# Altium schematic sheet kien1_SCH.SchDoc
size 381 x 241 mm; SheetNumber: 1; SheetTotal: 1
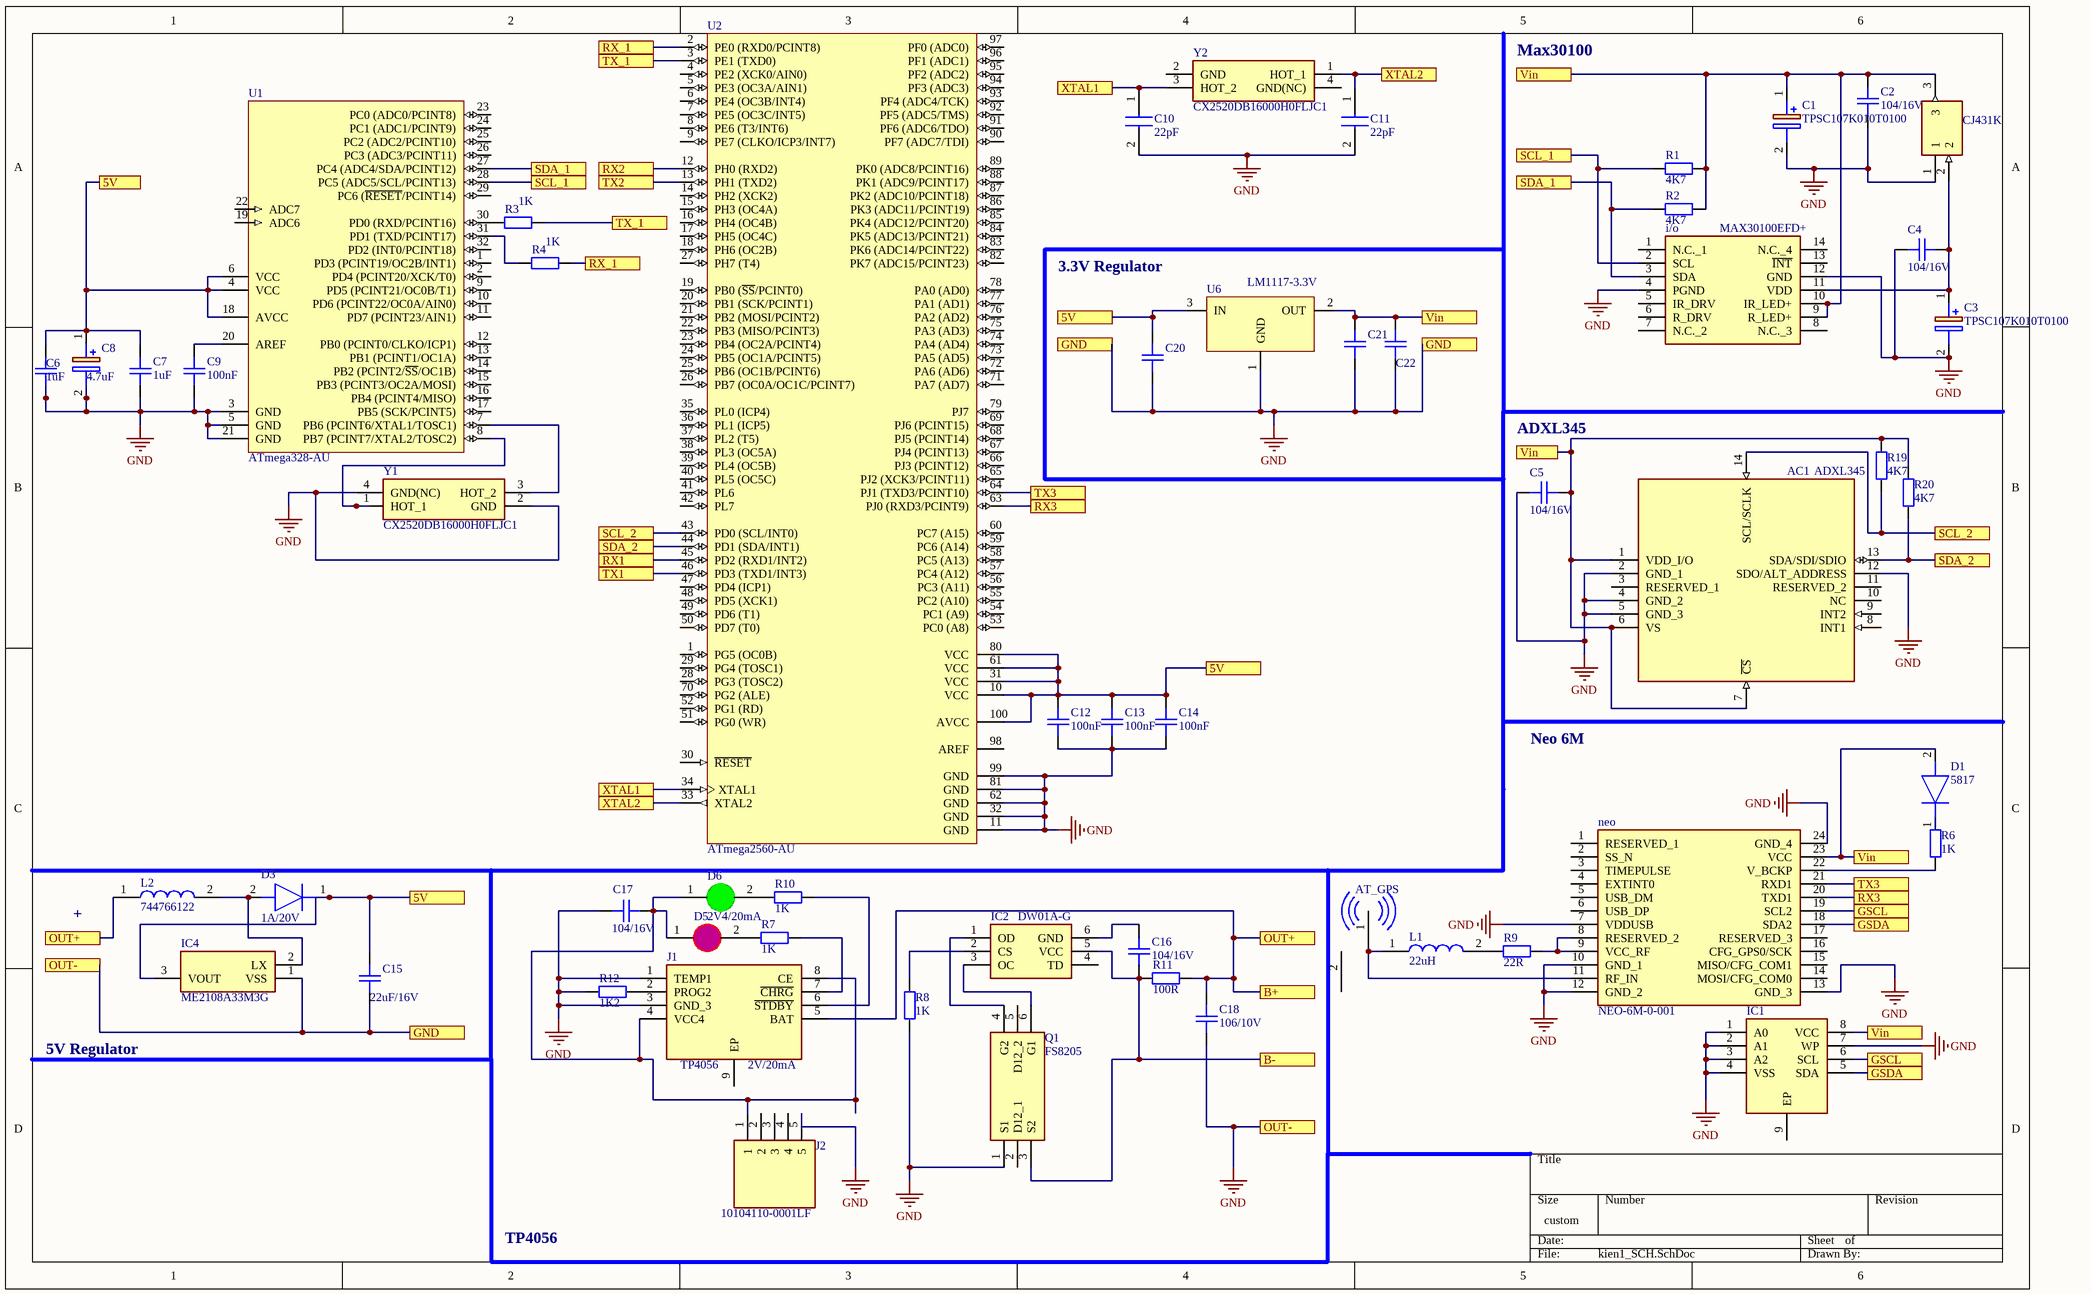
[diagram p0: kien1_SCH.SchDoc]

## Parts
?  CJ431K  [SOT92P240X115-3N]
AC1  ADXL345  [CC-14-1]
AT_GPS  IPEX_CON  [U.FL/UMCC]  (value not drawn)
C1  TPSC107K010T0100  [CAPPM6032X280N]
C2  104/16V  [CAPC-0402 (1005)]
C3  TPSC107K010T0100  [CAPPM6032X280N]
C4  104/16V  [CAPC-0402 (1005)]
C5  104/16V  [CAPC-0402 (1005)]
C6  1uF  [CAPC-0402 (1005)]
C7  1uF  [CAPC-0402 (1005)]
C8  4.7uF  [CAPPM3528X210N]
C9  100nF  [CAPC-0402 (1005)]
C10  22pF  [C0402]
C11  22pF  [C0402]
C12  100nF  [CAPC-0402 (1005)]
C13  100nF  [CAPC-0402 (1005)]
C14  100nF  [CAPC-0402 (1005)]
C15  22uF/16V  [CAPC-0603 (1608)]
C16  104/16V  [CAPC-0402 (1005)]
C17  104/16V  [CAPC-0402 (1005)]
C18  106/10V  [CAPC-0603 (1608)]
C20  (no value)  [CAPC-0603 (1608)]
C21  (no value)  [CAPC-0603 (1608)]
C22  (no value)  [CAPC-0402 (1005)]
D1  5817  [CD123DB120R]
D3  1A/20V  [NSR10F20NXT5G]
D5  2V/20mA  [LED_0805_RED]
D6  2V4/20mA  [LED_0805_GREEN]
i/o  MAX30100EFD+  [MAX30100EFD]
IC1  (no value)  [SON50P300X200X100-9N-D]
IC2  DW01A-G  [SOT95P280X135-6N]
IC4  ME2108A33M3G  [SOT95P250X130-3N]
J1  TP4056  [SOIC127P600X175-9N]
J2  10104110-0001LF  [101041100001LF]
L1  22uH  [INDPM4532X360N]
L2  744766122  [INDPM4532X360N]
neo  NEO-6M-0-001  [NEO6M0001]
Q1  FS8205  [FS8205]
R1  4K7  [RESC-0603 (1608)]
R2  4K7  [RESC-0603 (1608)]
R3  1K  [RESC-0603 (1608)]
R4  1K  [RESC-0603 (1608)]
R6  1K  [RESC-0603 (1608)]
R7  1K  [RESC-0603 (1608)]
R8  1K  [RESC-0603 (1608)]
R9  22R  [RESC-0603 (1608)]
R10  1K  [RESC-0603 (1608)]
R11  100R  [RESC-0603 (1608)]
R12  1K2  [RESC-0603 (1608)]
R19  4K7  [RESC-0603 (1608)]
R20  4K7  [RESC-0603 (1608)]
U1  ATmega328-AU  [TQFP32]
U2  ATmega2560-AU  [TQFP100L]
U6  LM1117-3.3V  [SOT223]
Y1  CX2520DB16000H0FLJC1  [CX2520DB16000H0FLJC1]
Y2  CX2520DB16000H0FLJC1  [CX2520DB16000H0FLJC1]

## Ports
5V, B+, B-, GND, GSCL, GSDA, OUT+, OUT-, RX1, RX2, RX3, RX_1, SCL_1, SCL_2, SDA_1, SDA_2, TX1, TX2, TX3, TX_1, Vin, XTAL1, XTAL2

## Nets
GND: ?.1 AC1.2(GND_1) AC1.4(GND_2) AC1.5(GND_3) AC1.12(SDO/ALT_ADDRESS) C1.2(-) C2.2 C3.2(-) C4.1 C5.1 C6.2 C7.2 C8.2(-) C9.2 C10.2 C11.2 C12.2 C13.2 C14.2 C15.2 C17.1 C18.2 C20.2 C21.2 C22.2 i/o.4(PGND) i/o.12(GND) IC1.1(A0) IC1.2(A1) IC1.3(A2) IC1.4(VSS) IC1.7(WP) IC4.1(VSS) J1.1(TEMP1) J1.3(GND_3) J2.5 neo.7(VDDUSB) neo.10(GND_1) neo.12(GND_2) neo.13(GND_3) neo.24(GND_4) Q1.1(S1) R8.2 R12.1 U1.3(GND) U1.5(GND) U1.21(GND) U2.11(GND) U2.32(GND) U2.62(GND) U2.81(GND) U2.99(GND) U6.1(GND) Y1.2(GND) Y1.4(GND(NC)) ; port GND, port OUT-
5V: C6.1 C7.1 C8.1(+) C12.1 C13.1 C14.1 C15.1 C20.1 D3.1(K) IC4.3(VOUT) U1.4(VCC) U1.6(VCC) U1.18(AVCC) U2.10(VCC) U2.31(VCC) U2.61(VCC) U2.80(VCC) U2.100(AVCC) U6.3(IN) ; port 5V
B+: C18.1 J1.5(BAT) L2.1 R11.2 ; port OUT+, port B+
B-: C16.2 IC2.5(VCC) Q1.3(S2) R11.1 ; port B-
GSCL: IC1.6(SCL) neo.19(SCL2) ; port GSCL
GSDA: IC1.5(SDA) neo.18(SDA2) ; port GSDA
RX1: U2.45(PD2_(RXD1/INT2)) ; port RX1
RX2: U2.12(PH0_(RXD2)) ; port RX2
RX3: neo.20(TXD1) U2.63(PJ0_(RXD3/PCINT9)) ; port RX3
RX_1: R4.2 U2.2(PE0_(RXD0/PCINT8)) ; port RX_1
SCL_1: i/o.2(SCL) R1.1 U1.28(PC5_(ADC5/SCL/PCINT13)) ; port SCL_1
SCL_2: AC1.14(SCL/SCLK) R19.2 U2.43(PD0_(SCL/INT0)) ; port SCL_2
SDA_1: i/o.3(SDA) R2.1 U1.27(PC4_(ADC4/SDA/PCINT12)) ; port SDA_1
SDA_2: AC1.13(SDA/SDI/SDIO) R20.2 U2.44(PD1_(SDA/INT1)) ; port SDA_2
TX1: U2.46(PD3_(TXD1/INT3)) ; port TX1
TX2: U2.13(PH1_(TXD2)) ; port TX2
TX3: neo.21(RXD1) U2.64(PJ1_(TXD3/PCINT10)) ; port TX3
TX_1: R3.2 U2.3(PE1_(TXD0)) ; port TX_1
Vin: ?.3 AC1.1(VDD_I/O) AC1.6(VS) AC1.7(~{CS}) C1.1(+) C2.1 C5.2 C21.1 C22.1 D1.2(A) i/o.9(R_LED+) i/o.10(IR_LED+) IC1.8(VCC) neo.23(VCC) R1.2 R2.2 R19.1 R20.1 U6.2(OUT) ; port Vin
XTAL1: C10.1 U2.34(XTAL1) Y2.3(HOT_2) ; port XTAL1
XTAL2: C11.1 U2.33(XTAL2) Y2.1(HOT_1) ; port XTAL2
Net?_2: ?.2 C3.1(+) C4.2 i/o.11(VDD)
NetAT_GPS_1: AT_GPS.1(AT) L1.1 neo.11(RF_IN)
NetC9_1: C9.1 U1.20(AREF)
NetC16_1: C16.1 IC2.6(GND)
NetC17_2: C17.2 D5.1(A) D6.1(A) J1.4(VCC4) J1.8(CE) J2.1
NetD1_1: D1.1(K) R6.1
NetD3_2: D3.2(A) IC4.2(LX) L2.2
NetD5_2: D5.2(K) R7.1
NetD6_2: D6.2(K) R10.1
NetIC2_1: IC2.1(OD) Q1.4(G2)
NetIC2_2: IC2.2(CS) R8.1
NetIC2_3: IC2.3(OC) Q1.6(G1)
NetJ1_2: J1.2(PROG2) R12.2
NetJ1_6: J1.6(~{STDBY}) R10.2
NetJ1_7: J1.7(~{CHRG}) R7.2
NetL1_2: L1.2 R9.1
Netneo_8: neo.8(RESERVED_2) neo.9(VCC_RF) R9.2
Netneo_22: neo.22(V_BCKP) R6.2
NetR3_1: R3.1 U1.30(PD0_(RXD/PCINT16))
NetR4_1: R4.1 U1.31(PD1_(TXD/PCINT17))
NetU1_7: U1.7(PB6_(PCINT6/XTAL1/TOSC1)) Y1.3(HOT_2)
NetU1_8: U1.8(PB7_(PCINT7/XTAL2/TOSC2)) Y1.1(HOT_1)

Not connected (* = marked no-connect by the designer): AC1 3(RESERVED_1) 8(INT1) 9(INT2) 10(NC) 11(RESERVED_2); AT_GPS 2(0); i/o 1(N.C._1) 5(IR_DRV) 6(R_DRV) 7(N.C._2) 8(N.C._3) 13(~{INT}) 14(N.C._4); IC1 9(EP); IC2 4(TD); J1 9(EP); J2 2 3 4; neo 1(RESERVED_1) 2(SS_N) 3(TIMEPULSE) 4(EXTINT0) 5(USB_DM) 6(USB_DP) 14(MOSI/CFG_COM0) 15(MISO/CFG_COM1) 16(CFG_GPS0/SCK) 17(RESERVED_3); Q1 2(D12_1) 5(D12_2); U1 1(PD3_(PCINT19/OC2B/INT1)) 2(PD4_(PCINT20/XCK/T0)) 9(PD5_(PCINT21/OC0B/T1)) 10(PD6_(PCINT22/OC0A/AIN0)) 11(PD7_(PCINT23/AIN1)) 12(PB0_(PCINT0/CLKO/ICP1)) 13(PB1_(PCINT1/OC1A)) 14(PB2_(PCINT2/~{SS}/OC1B)) 15(PB3_(PCINT3/OC2A/MOSI)) 16(PB4_(PCINT4/MISO)) 17(PB5_(SCK/PCINT5)) 19(ADC6) 22(ADC7) 23(PC0_(ADC0/PCINT8)) 24(PC1_(ADC1/PCINT9)) 25(PC2_(ADC2/PCINT10)) 26(PC3_(ADC3/PCINT11)) 29(PC6_(~{RESET}/PCINT14)) 32(PD2_(INT0/PCINT18)); U2 1(PG5_(OC0B)) 4(PE2_(XCK0/AIN0)) 5(PE3_(OC3A/AIN1)) 6(PE4_(OC3B/INT4)) 7(PE5_(OC3C/INT5)) 8(PE6_(T3/INT6)) 9(PE7_(CLKO/ICP3/INT7)) 14(PH2_(XCK2)) 15(PH3_(OC4A)) 16(PH4_(OC4B)) 17(PH5_(OC4C)) 18(PH6_(OC2B)) 19(PB0_(~{SS}/PCINT0)) 20(PB1_(SCK/PCINT1)) 21(PB2_(MOSI/PCINT2)) 22(PB3_(MISO/PCINT3)) 23(PB4_(OC2A/PCINT4)) 24(PB5_(OC1A/PCINT5)) 25(PB6_(OC1B/PCINT6)) 26(PB7_(OC0A/OC1C/PCINT7)) 27(PH7_(T4)) 28(PG3_(TOSC2)) 29(PG4_(TOSC1)) 30(~{RESET}) 35(PL0_(ICP4)) 36(PL1_(ICP5)) 37(PL2_(T5)) 38(PL3_(OC5A)) 39(PL4_(OC5B)) 40(PL5_(OC5C)) 41(PL6) 42(PL7) 47(PD4_(ICP1)) 48(PD5_(XCK1)) 49(PD6_(T1)) 50(PD7_(T0)) 51(PG0_(WR)) 52(PG1_(RD)) 53(PC0_(A8)) 54(PC1_(A9)) 55(PC2_(A10)) 56(PC3_(A11)) 57(PC4_(A12)) 58(PC5_(A13)) 59(PC6_(A14)) 60(PC7_(A15)) 65(PJ2_(XCK3/PCINT11)) 66(PJ3_(PCINT12)) 67(PJ4_(PCINT13)) 68(PJ5_(PCINT14)) 69(PJ6_(PCINT15)) 70(PG2_(ALE)) 71(PA7_(AD7)) 72(PA6_(AD6)) 73(PA5_(AD5)) 74(PA4_(AD4)) 75(PA3_(AD3)) 76(PA2_(AD2)) 77(PA1_(AD1)) 78(PA0_(AD0)) 79(PJ7) 82(PK7_(ADC15/PCINT23)) 83(PK6_(ADC14/PCINT22)) 84(PK5_(ADC13/PCINT21)) 85(PK4_(ADC12/PCINT20)) 86(PK3_(ADC11/PCINT19)) 87(PK2_(ADC10/PCINT18)) 88(PK1_(ADC9/PCINT17)) 89(PK0_(ADC8/PCINT16)) 90(PF7_(ADC7/TDI)) 91(PF6_(ADC6/TDO)) 92(PF5_(ADC5/TMS)) 93(PF4_(ADC4/TCK)) 94(PF3_(ADC3)) 95(PF2_(ADC2)) 96(PF1_(ADC1)) 97(PF0_(ADC0)) 98(AREF); Y2 2(GND) 4(GND(NC))

## Notes on the sheet
- Max30100
- 3.3V Regulator
- ADXL345
- Neo 6M
- +
- 5V Regulator
- TP4056

## Library data of the parts
? = CJ431K: Integrated Circuit; Manufacturer_Name: Changjiang Electronics Tech (CJ); Datasheet Link: https://datasheet.lcsc.com/szlcsc/Changjiang-Electronics-Tech-CJ-CJ431K_C67383.pdf; Height: 1.15mm; Manufacturer_Part_Number: CJ431K
AC1 = ADXL345: Accelerometer; Manufacturer_Name: Analog Devices; Datasheet Link: http://www.analog.com/media/en/technical-documentation/data-sheets/ADXL345.pdf; Manufacturer_Part_Number: ADXL345; Mouser Part Number: N/A; Mouser Price/Stock: https://www.mouser.co.uk/ProductDetail/Analog-Devices/ADXL345?qs=5aG0NVq1C4y%252BItyqaAF9pQ%3D%3D
AT_GPS = LTI-IPXSM66AL: IPEX CONNECTER ANTENNA GPS GSM; Solder: SMT; MPN: LTI-IPXSM66AL; Value: IPEX_CON
C1 C3 = TPSC107K010T0100: Capacitor Polarised; Manufacturer_Name: AVX; Datasheet Link: http://datasheets.avx.com/TPS_AUTO.pdf; Height: 2.8mm; Manufacturer_Part_Number: TPSC107K010T0100; Mouser Part Number: 581-TPSC107K010T0100; Mouser Price/Stock: https://www.mouser.co.uk/ProductDetail/AVX/TPSC107K010T0100?qs=W0yvOO0ixfG5lUxjN8PSqA%3D%3D; Arrow Part Number: TPSC107K010T0100; Arrow Price/Stock: https://www.arrow.com/en/products/tpsc107k010t0100/avx
C2 C4 C5 C16 C17 = CC0402KRX7R7BB104: CAP CER 0.1UF 16V X7R 0402; MPR: Yageo; Sloder: SMD; MPN: CC0402KRX7R7BB104; Category: Capacitor; Value: 104/16V
C6 C7 = CC0402KRX5R5BB105: CAP CER 1UF 6.3V X5R 0402; MPR: Yageo; Sloder: 0402; Value: 105/6.3V; MPN: CC0402KRX5R5BB105; Manufactory: Yageo; Category: Capacitor
C8 = TL3B475M016C2900: Capacitor Polarised; Manufacturer_Name: Vishay; Datasheet Link: http://www.vishay.com/doc?40154; Height: 2.1mm; Manufacturer_Part_Number: TL3B475M016C2900
C9 C12-C14 = CC0402KRX7R7BB104: CAP CER 0.1UF 16V X7R 0402; MPR: Yageo; Sloder: SMD; Value: 104/16V; MPN: CC0402KRX7R7BB104; Category: Capacitor
C10 C11 = C0402C220J4GACAUTO: Capacitor; Manufacturer_Name: KEMET; Datasheet Link: https://content.kemet.com/datasheets/KEM_C1022_C0G_AUTO_SMD.pdf; Height: 0.55mm; Manufacturer_Part_Number: C0402C220J4GACAUTO; Mouser Part Number: 80-C0402C220J4GAUTO; Mouser Price/Stock: https://www.mouser.co.uk/ProductDetail/KEMET/C0402C220J4GACAUTO?qs=PqoDHHvF64%252Bwa4ISBxnBSA%3D%3D
C15 = CL10A226MO7JZNC: CAP CER 22UF 16V X5R 0603; Solder: SMT; MPN: CL10A226MO7JZNC; Value: 22uF/16V; Category: CAPACITOR; PinCount: 2
C18 = CL10A106KP8NNNC: CAP CER 10uF 10% 10V X5R 0603; CompanyID: VT-00984; Solder: SMT; MPN: CL10A106KP8NNNC; Value: 106/10V; Category: CAPACITOR; PinCount: 2
C20 = CL10A106KP8NNNC: CAP CER 10uF 10% 10V X5R 0603; CompanyID: VT-00984; Solder: SMT; Value: 106/10V; MPN: CL10A106KP8NNNC; Category: CAPACITOR; PinCount: 2
C21 = CL10A226MO7JZNC: CAP CER 22UF 16V X5R 0603; Solder: SMT; Value: 22uF/16V; MPN: CL10A226MO7JZNC; Category: CAPACITOR; PinCount: 2
C22 = GRM155R71A104JA01D: CAP CER 0.1UF 10V X7R 0402; MFR: Murata Electronics; Sloder: 0402; MPN: GRM155R71A104JA01D; Category: Capacitor
D1 = CD123D-B120R: Diode; Manufacturer_Name: Bourns; Datasheet Link: https://www.mouser.com/datasheet/2/54/bourns_CD123D-B1xR-1159223.pdf; Height: 1.16mm; Manufacturer_Part_Number: CD123D-B120R; Mouser Part Number: 652-CD123D-B120R; Mouser Price/Stock: https://www.mouser.co.uk/ProductDetail/Bourns/CD123D-B120R?qs=xhbEVWpZdWd9fFlvin9bCQ%3D%3D; Arrow Part Number: CD123D-B120R; Arrow Price/Stock: https://www.arrow.com/en/products/cd123d-b120r/bourns?region=nac
D3 = NSR10F20NXT5G: Diode; Manufacturer_Name: onsemi; Datasheet Link: https://componentsearchengine.com/Datasheets/2/NSR10F20NXT5G.pdf; Height: 0.31mm; Manufacturer_Part_Number: NSR10F20NXT5G; Mouser Part Number: 863-NSR10F20NXT5G; Mouser Price/Stock: https://www.mouser.co.uk/ProductDetail/onsemi/NSR10F20NXT5G?qs=Ddzdinyxz%2FkokTQ%2FhtOuYg%3D%3D; Arrow Part Number: NSR10F20NXT5G; Arrow Price/Stock: https://www.arrow.com/en/products/nsr10f20nxt5g/on-semiconductor?region=nac
D5 = 17-215SURC/S530-A3/TR8: LED RED CLEAR 0805 SMD; Solder: SMT; CompanyID: VT-00379; Value: 2V/20mA; MPN: 17-215SURC/S530-A3/TR8
D6 = 17-21/G6C-FM1N2B/3T: LED GREEN CLEAR 2V4 20mA 0805 SMD; CompanyID: VT-00393; Solder: SMT; MPN: 17-21/G6C-FM1N2B/3T; Value: 2V4/20mA
i/o = MAX30100EFD+: Integrated Circuit; Manufacturer_Name: Maxim Integrated; Datasheet Link: https://datasheets.maximintegrated.com/en/ds/MAX30100.pdf; Height: 3mm; Manufacturer_Part_Number: MAX30100EFD+; Mouser Part Number: 700-MAX30100EFD+; Mouser Price/Stock: https://www.mouser.co.uk/ProductDetail/Maxim-Integrated/MAX30100EFD%2b?qs=Y0gyZw6qHXfLbN1SzW9wqw%3D%3D
IC1 = 24AA32AT-I_MC: Integrated Circuit; Manufacturer_Name: Microchip; Manufacturer_Part_Number: 24AA32AT-I/MC; Datasheet Link: http://uk.rs-online.com/web/p/products/8261540; Height: 1mm; Mouser Part Number: 579-24AA32AT-I/MC; Mouser Price/Stock: https://www.mouser.co.uk/ProductDetail/Microchip-Technology/24AA32AT-I-MC/?qs=3GBkE4%2F1xo7gRH46Ervlgw%3D%3D; Arrow Part Number: 24AA32AT-I/MC; Arrow Price/Stock: https://www.arrow.com/en/products/24aa32at-imc/microchip-technology
IC2 = DW01A-G: Integrated Circuit; Manufacturer_Name: Fortune Semiconductor Corporation; Datasheet Link: http://acoptex.com/uploads/DW01A.pdf; Height: 1.35mm; Manufacturer_Part_Number: DW01A-G
IC4 = ME2108A33M3G: Integrated Circuit; Manufacturer_Name: Microne; Datasheet Link: https://datasheet.lcsc.com/szlcsc/Nanjing-Micro-One-Elec-ME2108A50M3G_C14839.pdf; Height: 1.3mm; Manufacturer_Part_Number: ME2108A33M3G
J1 = TP4056: Connector; Manufacturer_Name: NanJing Top Power; Datasheet Link: https://dlnmh9ip6v2uc.cloudfront.net/datasheets/Prototyping/TP4056.pdf; Height: 1.75mm; Manufacturer_Part_Number: TP4056
J2 = 10104110-0001LF: Connector; Manufacturer_Name: Amphenol; Datasheet Link: https://componentsearchengine.com/Datasheets/1/10104110-0001LF.pdf; Height: 2.98mm; Manufacturer_Part_Number: 10104110-0001LF; Mouser Part Number: 649-10104110-0001LF; Mouser Price/Stock: https://www.mouser.co.uk/ProductDetail/Amphenol-FCI/10104110-0001LF?qs=3wMSRtz0%252BRoQF1VV4tle7w%3D%3D; Arrow Part Number: 10104110-0001LF; Arrow Price/Stock: https://www.arrow.com/en/products/10104110-0001lf/amphenol-fci?region=nac
L1 L2 = 744766122: Inductor; Manufacturer_Name: Wurth Elektronik; Datasheet Link: https://www.we-online.com/catalog/datasheet/744766122.pdf; Height: 3.6mm; Manufacturer_Part_Number: 744766122; Mouser Part Number: 710-744766122; Mouser Price/Stock: https://www.mouser.com/Search/Refine.aspx?Keyword=710-744766122
neo = NEO-6M-0-001: Integrated Circuit; Manufacturer_Name: U-Blox; Datasheet Link: https://www.u-blox.com/sites/default/files/products/documents/NEO-6_DataSheet_%28GPS.G6-HW-09005%29.pdf; Height: 2.6mm; Manufacturer_Part_Number: NEO-6M-0-001
Q1 = FS8205: MOSFET (N-Channel); Manufacturer_Name: Fortune Semiconductor Corporation; Datasheet Link: https://www.ic-fortune.com/upload/Download/FS8205-DS-19_EN.pdf; Height: 1mm; Manufacturer_Part_Number: FS8205
R1 R2 R19 R20 = RC0603FR-074K7L: RES SMD 4.7K OHM 1% 1/10W 0603; CompanyID: VT-00327; Solder: SMT; MPN: RC0603FR-074K7L; Value: 4K7; Category: RESISTOR
R3 R4 R6-R8 R10 = RC0603FR-071KL: RES SMD 1 KOHM 1% 1/10W 0603; CompanyID: VT-00574; Solder: SMT; MPN: RC0603FR-071KL; Value: 1K; Category: RESISTOR
R9 = RC0603FR-0722RL: RES SMD 22 OHM 1% 1/10W 0603; CompanyID: VT-00881; Solder: SMT; Value: 22R; MPN: RC0603FR-0722RL; Category: RESISTOR
R11 = RC0603FR-07100RL: RES SMD 100 OHM 1% 1/10W 0603; CompanyID: VT-00499; Solder: SMT; MPN: RC0603FR-07100RL; Value: 100R; Category: RESISTOR
R12 = RC0603FR-071K2L: RES SMD 1.2K OHM 1% 1/10W 0603; CompanyID: VT-01075; Solder: SMT; Value: 1K2; MPN: RC0603FR-071K2L; Category: RESISTOR
U1 = ATmega328-AU: 8-bit AVR Microcontroller, 32KB Flash, 1KB EEPROM, 2KB SRAM, 32-pin TQFP, Industrial Grade (-40°C to 85°C); Published: 1-Apr-2010; DatasheetVersion: revA, Jan-2010; PackageVersion: revB, Oct-2001; PackageReference: 32A; Publisher: Altium Limited; PackageDescription: 32-Lead, 7x7x1.0 mm Body, 0.8mm Lead Pitch, Thin Profile Plastic Quad Flat Package (TQFP); Supplier 1: Digi-Key; Supplier Part Number 1: ATMEGA328-AU-ND; Supplier 2: Mouser; Supplier Part Number 2: 556-ATMEGA328-AU; Code_JEDEC: MS-026-ABA; ComponentLink1Description: Manufacturer Link; ComponentLink1URL: http://www.atmel.com/products/avr/default.asp?; ComponentLink2Description: ATmega48A/48PA/88A/88PA/168A/168PA/328/328P Datasheet; ComponentLink2URL: http://www.atmel.com/dyn/resources/prod_documents/8271.pdf; ComponentLink3Description: ATmega48A/48PA/88A/88PA/168A/168PA/328/328P Summary; ComponentLink3URL: http://www.atmel.com/dyn/resources/prod_documents/8271S.pdf; ComponentLink4Description: Atmel.com Home; ComponentLink4URL: http://www.atmel.com
U2 = ATmega2560-AU: 8-bit AVR Microcontroller, 4.5-5.5V, 256KB Flash, 4KB EEPROM, 8KB SRAM, 86 GPIO pins, 100-pin TQFP, Industrial Grade (-40°C to 85°C), Pb-Free; Supplier 1: Digi-Key; Supplier Part Number 1: ATMEGA2560-16AUR-ND
U6 = LM1117: 800mA Low-Dropout Linear Regulator; Creator: Nguyen Ba Bien; Website: http://group3i.net
Y1 Y2 = CX2520DB16000H0FLJC1: Crystal or Oscillator; Manufacturer_Name: KYOCERA; Datasheet Link: https://media.digikey.com/pdf/Data%20Sheets/AVX%20PDFs/CX2520DB_USY1M-H1-16429-00_Spec.pdf; Height: 0.55mm; Manufacturer_Part_Number: CX2520DB16000H0FLJC1; Mouser Part Number: 581-CX2520DB16000HLJ